# Altium schematic sheet Water Control.SchDoc
size A3
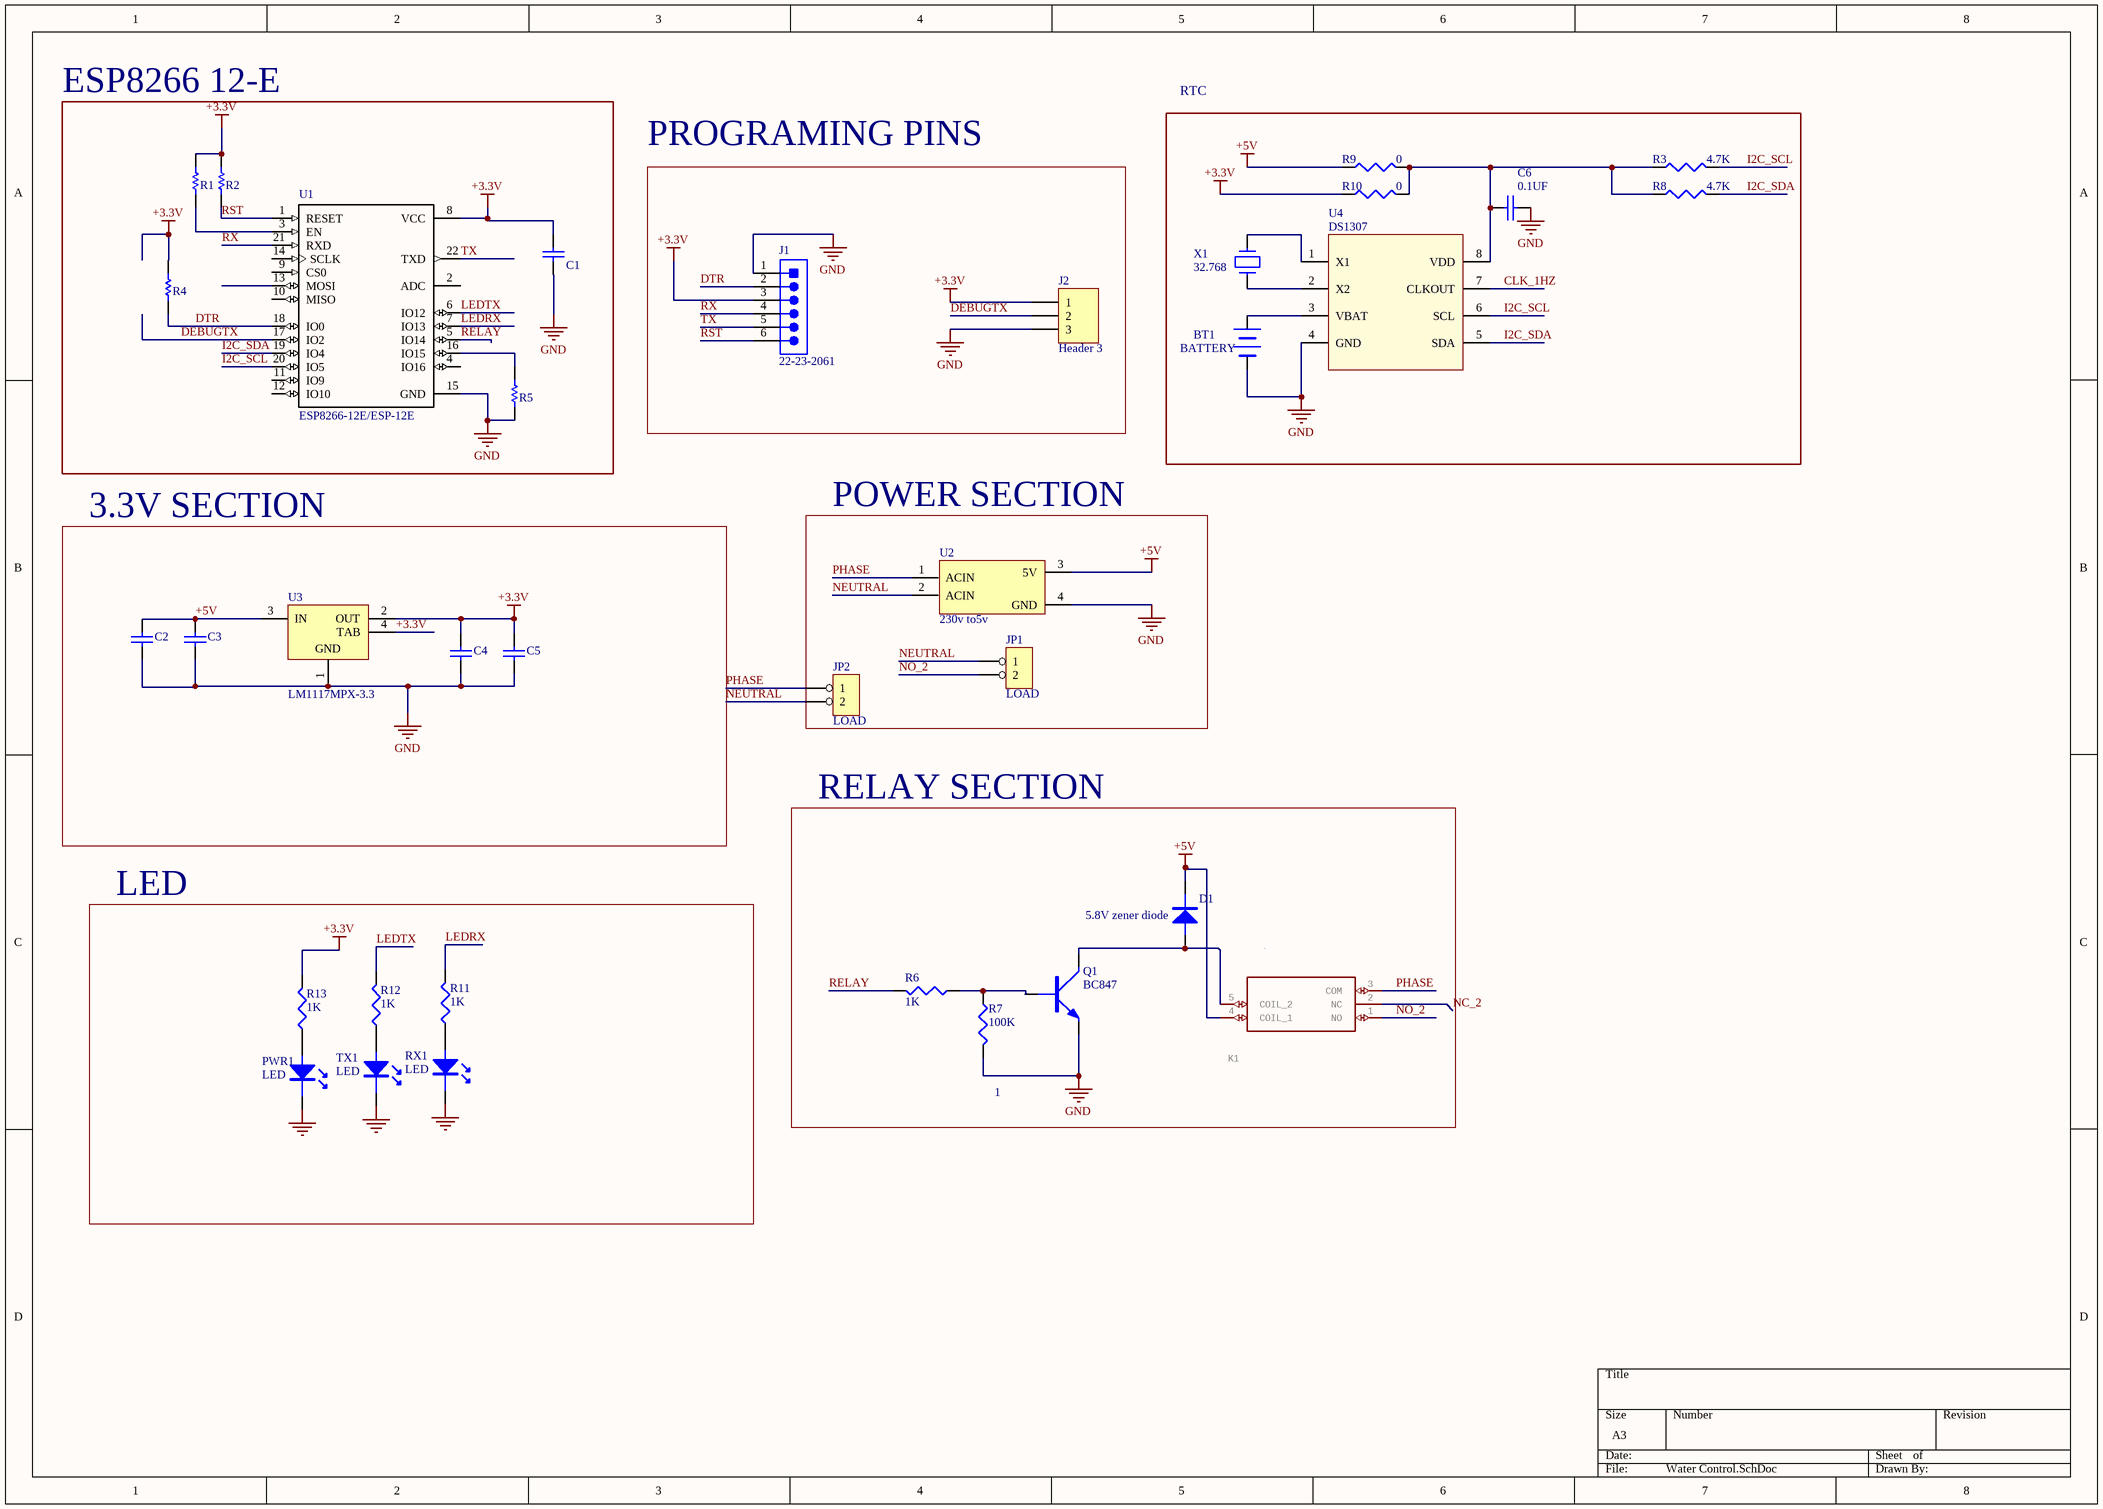
[diagram p0: Water Control.SchDoc]

## Parts
BT1  BATTERY  [CR2032_HOLDER_CH28]
C1  08055C104KAJ2A  [CAPC0805]  (value not drawn)
C2  CAP 2.7uF 10V 1206(3216)  [CAPC1206(3216)110_L]  (value not drawn)
C3  CAP 2.7uF 10V 1206(3216)  [CAPC1206(3216)110_L]  (value not drawn)
C4  CAP 2.7uF 10V 1206(3216)  [CAPC1206(3216)110_L]  (value not drawn)
C5  CAP 2.7uF 10V 1206(3216)  [CAPC1206(3216)110_L]  (value not drawn)
C6  0.1UF  [CAPC0805]
D1  5.8V zener diode  [BZT55B13GS08]
J1  22-23-2061  [HDR1X6]
J2  Header 3  [HDR1X3]
JP1  LOAD  [10 mm pitch]
JP2  LOAD  [10 mm pitch]
K1  Relays General Purpose Non Latching 12VDC SPDT 30A 250VAC Through Hole RoHS   Source:  Datasheet  [R53G112DF1S]  (value not drawn)
PWR1  LED  [Type 3mm]
Q1  BC847  [SOT23-3]
R1  2R55 1% 0805(2012)  [RESC0805(2012)_L]  (value not drawn)
R2  2R55 1% 0805(2012)  [RESC0805(2012)_L]  (value not drawn)
R3  4.7K  [RESC0805]
R4  2R55 1% 0805(2012)  [RESC0805(2012)_L]  (value not drawn)
R5  2R55 1% 0805(2012)  [RESC0805(2012)_L]  (value not drawn)
R6  1K  [RESC0805]
R7  100K  [RESC0805]
R8  4.7K  [RESC0805]
R9  0  [RESC0805]
R10  0  [RESC0805]
R11  1K  [RESC0805]
R12  1K  [RESC0805]
R13  1K  [RESC0805]
RX1  LED  [Type 3mm]
TX1  LED  [Type 3mm]
U1  ESP8266-12E/ESP-12E  [*XCVR_ESP8266-12E/ESP-12E]
U2  230v to5v  [230V-5V]
U3  LM1117MPX-3.3  [MP04A_N]
U4  DS1307  [SOIC8]
X1  32.768  [CRYSTAL_32.768_SMD]

## Blocks framed on the sheet
ESP8266 12-E: C1 R1 R2 R4 R5 U1
RTC: BT1 C6 R3 R8-R10 U4 X1
PROGRAMING PINS: J1 J2
3.3V SECTION: C2-C5 U3
POWER SECTION: JP1 JP2 U2
RELAY SECTION: D1 K1 Q1 R6 R7
LED: PWR1 R11-R13 RX1 TX1

## Nets
+3.3V: C1.1 C4.2 C5.2 J1.3 J2.1 R1.2 R2.2 R4.2 R10.1 R13.2 U1.8(VCC) U3.2(OUT) U3.4(TAB)
+5V: C2.2 C3.2 D1.2 K1.4(COIL_1) R9.1 U2.3(5V) U3.3(IN)
GND: BT1.2 C1.2 C2.1 C3.1 C4.1 C5.1 C6.1 J1.1 J2.3 PWR1.2(K) Q1.2(EMIT) R5.1 R7.2 RX1.2(K) TX1.2(K) U1.15(GND) U2.4(GND) U3.1(GND) U4.4(GND)
CLK_1HZ: U4.7(CLKOUT)
DEBUGT~{X}: J2.2 U1.17(IO2)
DTR: J1.2 R4.1 U1.18(IO0)
I2C_SCL: R3.2 U1.20(IO5) U4.6(SCL)
I2C_SDA: R8.2 U1.19(IO4) U4.5(SDA)
LEDRX: R11.2 U1.7(IO13)
LEDTX: R12.2 U1.6(IO12)
NC_2: K1.2(NC)
NEUTRAL: JP1.1 JP2.2 U2.2(ACIN)
NO_2: JP1.2 K1.1(NO)
PHASE: JP2.1 K1.3(COM) U2.1(ACIN)
RELAY: R6.2 U1.5(IO14)
RST: J1.6 R2.1 U1.1(RESET)
RX: J1.4 U1.21(RXD)
TX: J1.5 U1.22(TXD)
NetBT1_1: BT1.1 U4.3(VBAT)
NetC6_2: C6.2 R3.1 R8.1 R9.2 R10.2 U4.8(VDD)
NetD1_1: D1.1 K1.5(COIL_2) Q1.3(COLL)
NetPWR1_1: PWR1.1(A) R13.1
NetQ1_1: Q1.1(BASE) R6.1 R7.1
NetR1_1: R1.1 U1.3(EN)
NetR5_2: R5.2 U1.16(IO15)
NetR11_1: R11.1 RX1.1(A)
NetR12_1: R12.1 TX1.1(A)
NetU4_1: U4.1(X1) X1.1
NetU4_2: U4.2(X2) X1.2

Not connected (* = marked no-connect by the designer): U1 2(ADC) 4(IO16) 9(CS0) 10(MISO) 11(IO9) 12(IO10) 13(MOSI) 14(SCLK)

## Notes on the sheet
- (near R7) 1

## Library data of the parts
C1 = CMP-2007-04765-1: Manufacturer: AVX Interconnect / Elco; Part Number: 08055C104KAJ2A
C2-C5 = CMP-1037-04841-1: CAP 2.7uF 10V ±10% 1206 (3216 Metric) Thickness 1.05mm SMD; Case-Metric: 3216; Tolerance: Â±10%; Case-EIA: 1206; Max Thickness: 1.05 mm; Rated Voltage: 10 V; Value: 2.7uF; Technology: SMT
C6 = CAP NP
D1 = DIODE
J1 = CMP-2000-05536-1: Male Header, Pitch 2.54 mm, 1 x 6 Position, Height 10.67 mm, Tail Length 3.56 mm, 0 to 70 degC, RoHS, Bulk; Manufacturer: Molex; Pitch: 2.54mm; Mounting Angle: Vertical; Current Rating: 4A; Number of Positions / Contacts: 6; Voltage Rating: 250V; Packaging: Bulk; Package Description: Male Header, Pitch 2.54 mm, 1 x 6 Position, Height 10.67 mm, Tail Length 3.56 mm; Number of Rows: 1; Type: PinStrip; Contact Material: Brass; Product Category: .100K.K.Connectors; Factory Pack Quantity: 1000; Mounting Style: ThroughHole; RoHS: Details; Contact Plating: Tin; Housing Material: Nylon; Mounting Technology: ThroughHole; Termination Style: ThroughHole; Tradename: KK; Number of Positions: 6; Brand: Molex; Product Type: Headers; Series: 6373; Datasheet URL: https://datasheet.ciiva.com/19460/232303-19460895.pdf; Package Reference: 22-23-2061; Datasheet Version: Rev. P, 09/2001; Manufacturer URL: http://www.molex.com/
J2 = Header 3: Header, 3-Pin; LatestRevisionDate: 17-Jul-2002; LatestRevisionNote: Re-released for DXP Platform.; Publisher: Altium Limited
JP1 JP2 = HEADER 2
K1 = R53G-112DF-1-S: Manufacturer_Name: WRG(Wangrong); GateName_1: G$1; SymbolName_1: R53G-112DF-1-S; LibraryName: R53G-112DF-1-S; DeviceSetName: R53G-112DF-1-S; Package: R53G112DF1S; Manufacturer_Part_Number: R53G-112DF-1-S; Height: 20.3mm
PWR1 RX1 TX1 = LED: pin to pad: 1>2 2>1
Q1 = NPN BEC
R1 R2 R4 R5 = CMP-1013-00215-1: 2R55 0.125W 1% 0805 (2012 Metric)  SMD; Case-Metric: 2012; Value: 2.55 Ohm; Case-EIA: 0805; Tolerance: 1 %; Technology: SMT; Power: 0.125 W
R3 R6-R13 = RES1: RESISTOR
U1 = ESP8266-12E/ESP-12E: This WiFi module has a 32-bit MCU micro and clock speeds supporting 80 MHz or 160 MHz. Supports the RTOS and integrated Wi-Fi MAC/BB/RF/PA/LNA, and has an on-board antenna.; MF: AI-Thinker; Availability: Unavailable; MP: ESP8266-12E/ESP-12E; Price: None; SnapEDA_Link: https://www.snapeda.com/parts/ESP8266-12E/ESP-12E/AI-Thinker/view-part/?ref=snap; Package: None; Value: *
U2 = 230v to5v: pin to pad: 3>4 4>3
U3 = CMP-0062-01659-3: 800mA Low-Dropout Linear Regulator, 4-pin SOT-223; Manufacturer: National Semiconductor; PowerWise: N; High-Reliability: Y; PackageTopMarking: XYTT*N05A; CompType: LDO IC; DatasheetVersion: Apr-2006; PackageDescription: Molded SOT-223, 6.50 x 3.56 x 1.6mm Body, 4 Lead, 2.3mm Pitch; ComponentLink1Description: Manufacturer URL; ComponentLink4Description: MP04A Package Page; PartNumber: LM1117MPX-3.3; ComponentLink3URL: http://www.national.com/pf/LM/LM1117.html; ComponentLink2Description: LM1117 Datasheet; Code_JEDEC: TO-261-AA; ComponentLink4URL: http://www.national.com/packaging/folders/mp04a.html; Code_IPC: SOT223-4; RevisionNote: SCH symbol layout adjusted; PackageVersion: revB, Apr-2003; RoHS: N; PackageReference: MP04A; ComponentLink1URL: http://www.national.com/; ComponentLink2URL: http://www.national.com/ds/LM/LM1117.pdf; PinCount: 4; ComponentLink3Description: LM1117 Web Page
X1 = CRYSTAL